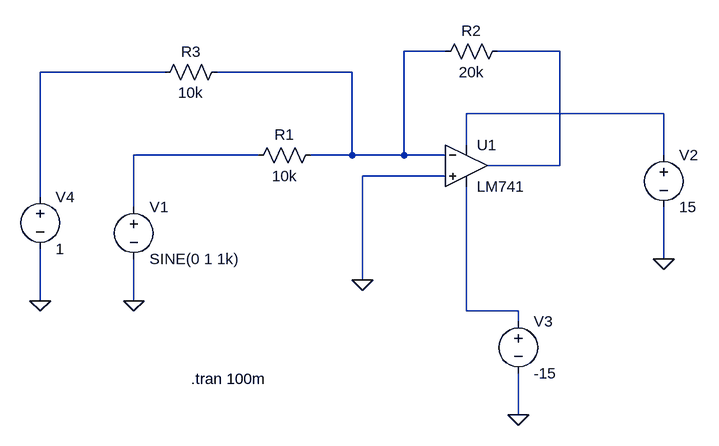
[diagram p0: schematic negatif_toplayıcı_lm741.asc]
negatif_toplayıcı_lm741.asc, the LTspice schematic file:
Version 4
SHEET 1 880 680
WIRE -32 96 -96 96
WIRE 144 96 48 96
WIRE -464 128 -656 128
WIRE -176 128 -384 128
WIRE 304 192 0 192
WIRE 0 240 0 192
WIRE -320 256 -512 256
WIRE -176 256 -176 128
WIRE -176 256 -240 256
WIRE -96 256 -96 96
WIRE -96 256 -176 256
WIRE -32 256 -96 256
WIRE 304 256 304 192
WIRE 144 272 144 96
WIRE 144 272 32 272
WIRE -32 288 -160 288
WIRE -656 320 -656 128
WIRE -512 336 -512 256
WIRE 304 416 304 336
WIRE -160 448 -160 288
WIRE -656 480 -656 400
WIRE -512 480 -512 416
WIRE 0 496 0 304
WIRE 80 496 0 496
WIRE 80 512 80 496
WIRE 80 656 80 592
FLAG -512 480 0
FLAG -160 448 0
FLAG 80 656 0
FLAG 304 416 0
FLAG -656 480 0
SYMBOL OpAmps\\LM741 0 208 R0
SYMATTR InstName U1
SYMBOL voltage -512 320 R0
WINDOW 123 0 0 Left 0
WINDOW 39 0 0 Left 0
SYMATTR InstName V1
SYMATTR Value SINE(0 1 1k)
SYMBOL res -224 240 R90
WINDOW 0 0 56 VBottom 2
WINDOW 3 32 56 VTop 2
SYMATTR InstName R1
SYMATTR Value 10k
SYMBOL res 64 80 R90
WINDOW 0 0 56 VBottom 2
WINDOW 3 32 56 VTop 2
SYMATTR InstName R2
SYMATTR Value 20k
SYMBOL voltage 304 240 R0
WINDOW 123 0 0 Left 0
WINDOW 39 0 0 Left 0
SYMATTR InstName V2
SYMATTR Value 15
SYMBOL voltage 80 496 R0
WINDOW 123 0 0 Left 0
WINDOW 39 0 0 Left 0
SYMATTR InstName V3
SYMATTR Value -15
SYMBOL voltage -656 304 R0
WINDOW 123 0 0 Left 0
WINDOW 39 0 0 Left 0
SYMATTR InstName V4
SYMATTR Value 1
SYMBOL res -368 112 R90
WINDOW 0 0 56 VBottom 2
WINDOW 3 32 56 VTop 2
SYMATTR InstName R3
SYMATTR Value 10k
TEXT -424 600 Left 2 !.tran 100m

The netlist it stands for:
* negatif_toplayıcı_lm741.asc
XU1 0 N001 N004 N006 N002 LM741  ; pins In+ In- V+ V- OUT
V1 N005 0 SINE(0 1 1k)
R1 N001 N005 10k
R2 N002 N001 20k
V2 N004 0 15
V3 N006 0 -15
V4 N003 0 1
R3 N001 N003 10k
.tran 100m
.lib LM741.lib
.backanno
.end